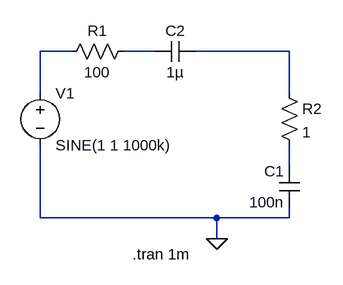
[diagram p0: schematic esr_meter.asc]
esr_meter.asc, the LTspice schematic file:
Version 4
SHEET 1 880 680
WIRE -80 48 -128 48
WIRE 48 48 0 48
WIRE 256 48 112 48
WIRE -128 112 -128 48
WIRE 256 112 256 48
WIRE 256 224 256 192
WIRE -128 304 -128 192
WIRE 144 304 -128 304
WIRE 256 304 256 288
WIRE 256 304 144 304
WIRE 144 336 144 304
FLAG 144 336 0
SYMBOL voltage -128 96 R0
WINDOW 123 0 0 Left 2
WINDOW 39 0 0 Left 2
SYMATTR InstName V1
SYMATTR Value SINE(1 1 1000k)
SYMBOL cap 272 288 R180
WINDOW 0 24 56 Left 2
WINDOW 3 24 8 Left 2
SYMATTR InstName C1
SYMATTR Value 100n
SYMBOL res 16 32 R90
WINDOW 0 0 56 VBottom 2
WINDOW 3 32 56 VTop 2
SYMATTR InstName R1
SYMATTR Value 100
SYMBOL res 240 96 R0
SYMATTR InstName R2
SYMATTR Value 1
SYMBOL cap 112 32 R90
WINDOW 0 0 32 VBottom 2
WINDOW 3 32 32 VTop 2
SYMATTR InstName C2
SYMATTR Value 1µ
TEXT 14 360 Left 2 !.tran 1m

The netlist it stands for:
* esr_meter.asc
V1 N001 0 SINE(1 1 1000k)
C1 0 N004 100n
R1 N002 N001 100
R2 N003 N004 1
C2 N003 N002 1µ
.tran 1m
.backanno
.end